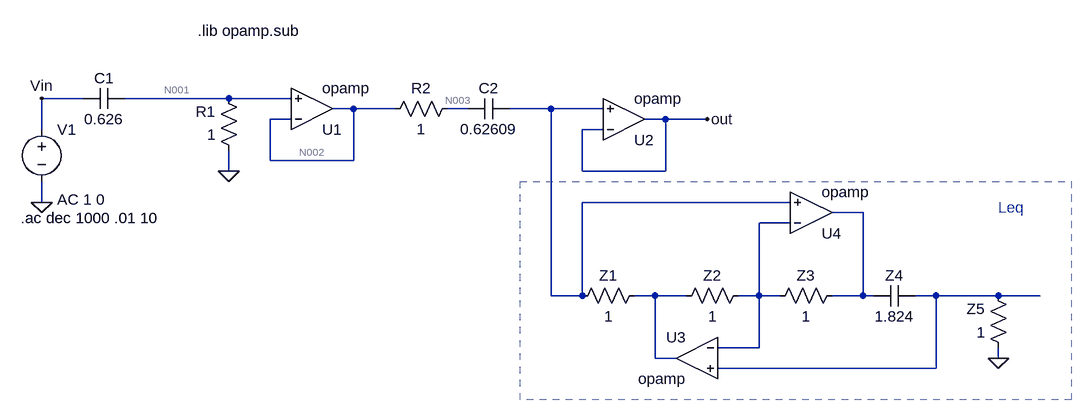
[diagram p0: schematic 26TS_3_gic.asc]
26TS_3_gic.asc, the LTspice schematic file:
Version 4.1
SHEET 1 1396 680
WIRE -128 80 -192 80
WIRE 96 80 -64 80
WIRE 192 80 96 80
WIRE 288 96 256 96
WIRE 352 96 288 96
WIRE 464 96 432 96
WIRE 592 96 528 96
WIRE 672 96 592 96
WIRE 192 112 160 112
WIRE 768 112 736 112
WIRE 832 112 768 112
WIRE -192 128 -192 80
WIRE 672 128 640 128
WIRE 160 176 160 112
WIRE 288 176 288 96
WIRE 288 176 160 176
WIRE 96 192 96 160
WIRE 640 192 640 128
WIRE 768 192 768 112
WIRE 768 192 640 192
WIRE -192 240 -192 208
WIRE 960 240 640 240
WIRE 1072 256 1024 256
WIRE 960 272 912 272
WIRE 592 384 592 96
WIRE 640 384 640 240
WIRE 640 384 592 384
WIRE 752 384 720 384
WIRE 800 384 752 384
WIRE 912 384 912 272
WIRE 912 384 880 384
WIRE 944 384 912 384
WIRE 1072 384 1072 256
WIRE 1072 384 1024 384
WIRE 1088 384 1072 384
WIRE 1184 384 1152 384
WIRE 1280 384 1184 384
WIRE 1344 384 1280 384
WIRE 912 464 912 384
WIRE 912 464 848 464
WIRE 752 480 752 384
WIRE 784 480 752 480
WIRE 1280 480 1280 464
WIRE 1184 496 1184 384
WIRE 1184 496 848 496
FLAG 96 192 0
FLAG -192 240 0
FLAG -192 80 Vin
FLAG 832 112 out
FLAG 1280 480 0
SYMBOL cap -64 64 R90
WINDOW 0 0 32 VBottom 2
WINDOW 3 32 32 VTop 2
SYMATTR InstName C1
SYMATTR Value 0.626
SYMBOL res 112 176 R180
WINDOW 0 36 76 Left 2
WINDOW 3 36 40 Left 2
SYMATTR InstName R1
SYMATTR Value 1
SYMBOL OpAmps\\opamp 224 160 M180
SYMATTR InstName U1
SYMBOL voltage -192 112 R0
WINDOW 123 24 124 Left 2
WINDOW 39 0 0 Left 0
SYMATTR Value2 AC 1 0
SYMATTR InstName V1
SYMATTR Value ""
SYMBOL cap 528 80 R90
WINDOW 0 0 32 VBottom 2
WINDOW 3 32 32 VTop 2
SYMATTR InstName C2
SYMATTR Value 0.62609
SYMBOL res 448 80 R90
WINDOW 0 0 56 VBottom 2
WINDOW 3 32 56 VTop 2
SYMATTR InstName R2
SYMATTR Value 1
SYMBOL OpAmps\\opamp 704 176 M180
SYMATTR InstName U2
SYMBOL res 736 368 R90
WINDOW 0 0 56 VBottom 2
WINDOW 3 32 56 VTop 2
SYMATTR InstName Z1
SYMATTR Value 1
SYMBOL res 896 368 R90
WINDOW 0 0 56 VBottom 2
WINDOW 3 32 56 VTop 2
SYMATTR InstName Z2
SYMATTR Value 1
SYMBOL res 1040 368 R90
WINDOW 0 0 56 VBottom 2
WINDOW 3 32 56 VTop 2
SYMATTR InstName Z3
SYMATTR Value 1
SYMBOL res 1296 480 R180
WINDOW 0 36 76 Left 2
WINDOW 3 36 40 Left 2
SYMATTR InstName Z5
SYMATTR Value 1
SYMBOL cap 1152 368 R90
WINDOW 0 0 32 VBottom 2
WINDOW 3 32 32 VTop 2
SYMATTR InstName Z4
SYMATTR Value 1.824
SYMBOL OpAmps\\opamp 816 416 M0
SYMATTR InstName U3
SYMBOL OpAmps\\opamp 992 320 M180
SYMATTR InstName U4
TEXT -224 264 Left 2 !.ac dec 1000 .01 10
TEXT 48 -24 Left 2 !.lib opamp.sub
TEXT 1280 248 Left 2 ;Leq
RECTANGLE Normal 1392 544 544 208 2

The netlist it stands for:
* 26TS_3_gic.asc
C1 N001 Vin 0.626
R1 0 N001 1
X§U1 N002 N001 N002 opamp Aol=100K GBW=10Meg  ; pins invin noninvin out
V1 Vin 0 AC 1 0
C2 N004 N003 0.62609
R2 N003 N002 1
X§U2 out N004 out opamp Aol=100K GBW=10Meg  ; pins invin noninvin out
R§Z1 N007 N004 1
R§Z2 N006 N007 1
R§Z3 N005 N006 1
R§Z5 0 N008 1
C§Z4 N008 N005 1.824
X§U3 N006 N008 N007 opamp Aol=100K GBW=10Meg  ; pins invin noninvin out
X§U4 N006 N004 N005 opamp Aol=100K GBW=10Meg  ; pins invin noninvin out
.ac dec 1000 .01 10
.lib opamp.sub
* Leq
.backanno
.end

* Results of the author's LTspice run, read from the files saved beside the schematic
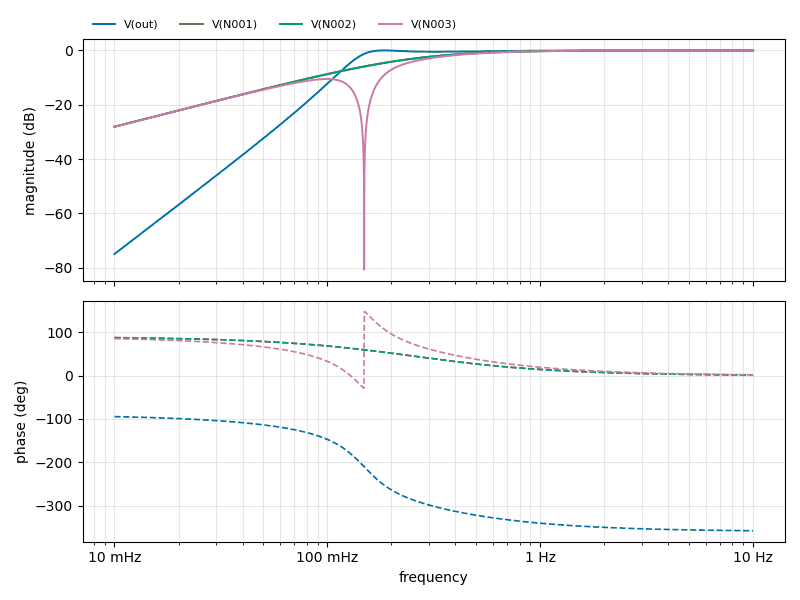
[diagram p1: AC Analysis of 26TS_3_gic.asc, plotted from the saved traces]
* AC Analysis, 1 run:
*   V(out): -75.00 dB at 10 mHz, -0.00 dB at 10 Hz, peak -0.00 dB at 10 Hz, 3 dB below the peak at 136.3 mHz
*   V(N001): -28.11 dB at 10 mHz, -0.00 dB at 10 Hz, peak -0.00 dB at 10 Hz, 3 dB below the peak at 254.1 mHz
*   V(N002): -28.11 dB at 10 mHz, -0.00 dB at 10 Hz, peak -0.00 dB at 10 Hz, 3 dB below the peak at 254.1 mHz
*   V(N003): -28.12 dB at 10 mHz, -0.00 dB at 10 Hz, peak -0.00 dB at 10 Hz, 3 dB below the peak at 296.8 mHz